# EAGLE schematic breakout_v0.3 (EAGLE 9.3.2)
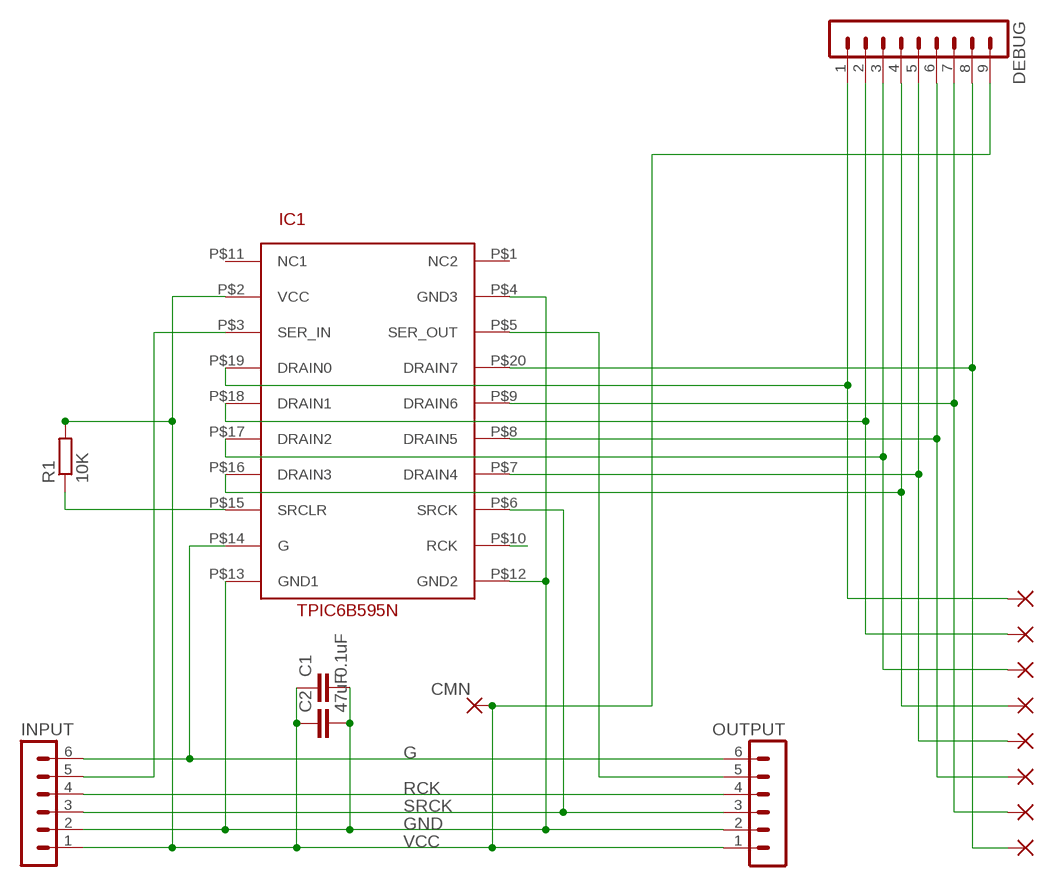
[diagram p0: schematic, sheet 1]

## Parts
C1  0.1uF  C-EU025-025X050  [C025-025X050]
C2  47uF  C-EU025-025X050  [C025-025X050]
CMN  1,6/0,8  [1,6/0,8]
DEBUG  MA09-1  [MA09-1]
DEC  1,6/0,8  [1,6/0,8]
INPUT  MA06-1  [MA06-1]
OUTPUT  MA06-1  [MA06-1]
R1  10K  R-EU_0207/7  [0207/7]
SEGA  1,6/0,8  [1,6/0,8]
SEGB  1,6/0,8  [1,6/0,8]
SEGC  1,6/0,8  [1,6/0,8]
SEGD  1,6/0,8  [1,6/0,8]
SEGE  1,6/0,8  [1,6/0,8]
SEGF  1,6/0,8  [1,6/0,8]
SEGG  1,6/0,8  [1,6/0,8]
U$1  TPIC6B595NPDIP-20  [PDIP-20]

## Nets
G: INPUT.6 OUTPUT.6 U$1.P$14(G)
GND [ground]: C1.2 C2.2 INPUT.2 OUTPUT.2 U$1.P$4(GND3) U$1.P$12(GND2) U$1.P$13(GND1)
N$1: DEBUG.1 SEGA.1(P) U$1.P$19(DRAIN0)
N$2: DEBUG.2 SEGB.1(P) U$1.P$18(DRAIN1)
N$3: DEBUG.3 SEGC.1(P) U$1.P$17(DRAIN2)
N$4: DEBUG.4 SEGD.1(P) U$1.P$16(DRAIN3)
N$5: DEBUG.5 SEGE.1(P) U$1.P$7(DRAIN4)
N$6: DEBUG.6 SEGF.1(P) U$1.P$8(DRAIN5)
N$7: DEBUG.7 SEGG.1(P) U$1.P$9(DRAIN6)
N$8: DEBUG.8 DEC.1(P) U$1.P$20(DRAIN7)
N$9: INPUT.5 U$1.P$3(SER_IN)
N$10: OUTPUT.5 U$1.P$5(SER_OUT)
N$12: U$1.P$10(RCK)
N$19: R1.1 U$1.P$15(SRCLR)
RCK: INPUT.4 OUTPUT.4
SRCK: INPUT.3 OUTPUT.3 U$1.P$6(SRCK)
VCC [vcc]: C1.1 C2.1 CMN.1(P) DEBUG.9 INPUT.1 OUTPUT.1 R1.2 U$1.P$2(VCC)
Unconnected: U$1.P$1(NC2) U$1.P$11(NC1)

## Library data of the parts
C1 C2 = rcl:C-EU: CAPACITOR, European symbol; SPICEPREFIX: C
CMN DEC SEGA SEGB SEGC SEGD SEGE SEGF SEGG = wirepad:1,6/0,8: THROUGH-HOLE PAD
DEBUG = con-lstb:MA09-1: PIN HEADER; OC_FARNELL: unknown; OC_NEWARK: unknown
INPUT OUTPUT = con-lstb:MA06-1: PIN HEADER; OC_FARNELL: unknown; OC_NEWARK: unknown
R1 = rcl:R-EU_: RESISTOR, European symbol; SPICEPREFIX: R
U$1 = tpic6b595n:TPIC6B595N

## Net classes
0 default: width 0.635 mm
1 ground: width 1.27 mm
2 vcc: width 1.27 mm
3 audio: width 1.27 mm